# Altium schematic sheet Tiresias_audio_codec.SchDoc: Audio Codec
size 393 x 281 mm; Author: João Victor Colombari Carlet; CompanyName: GMETA; DrawnBy: João Victor Colombari Carlet; Organization: R&D GMETA; Address1: EESC - USP; Address2: 400, Trabalhador São-Carlense Av.; Address3: 13566-590, São Carlos; Address4: São Paulo, Brazil; Revision: 0; SheetNumber: 3; SheetTotal: 5; Address_Website: http://www.sel.eesc.usp.br/jcarmo/metamaterials/
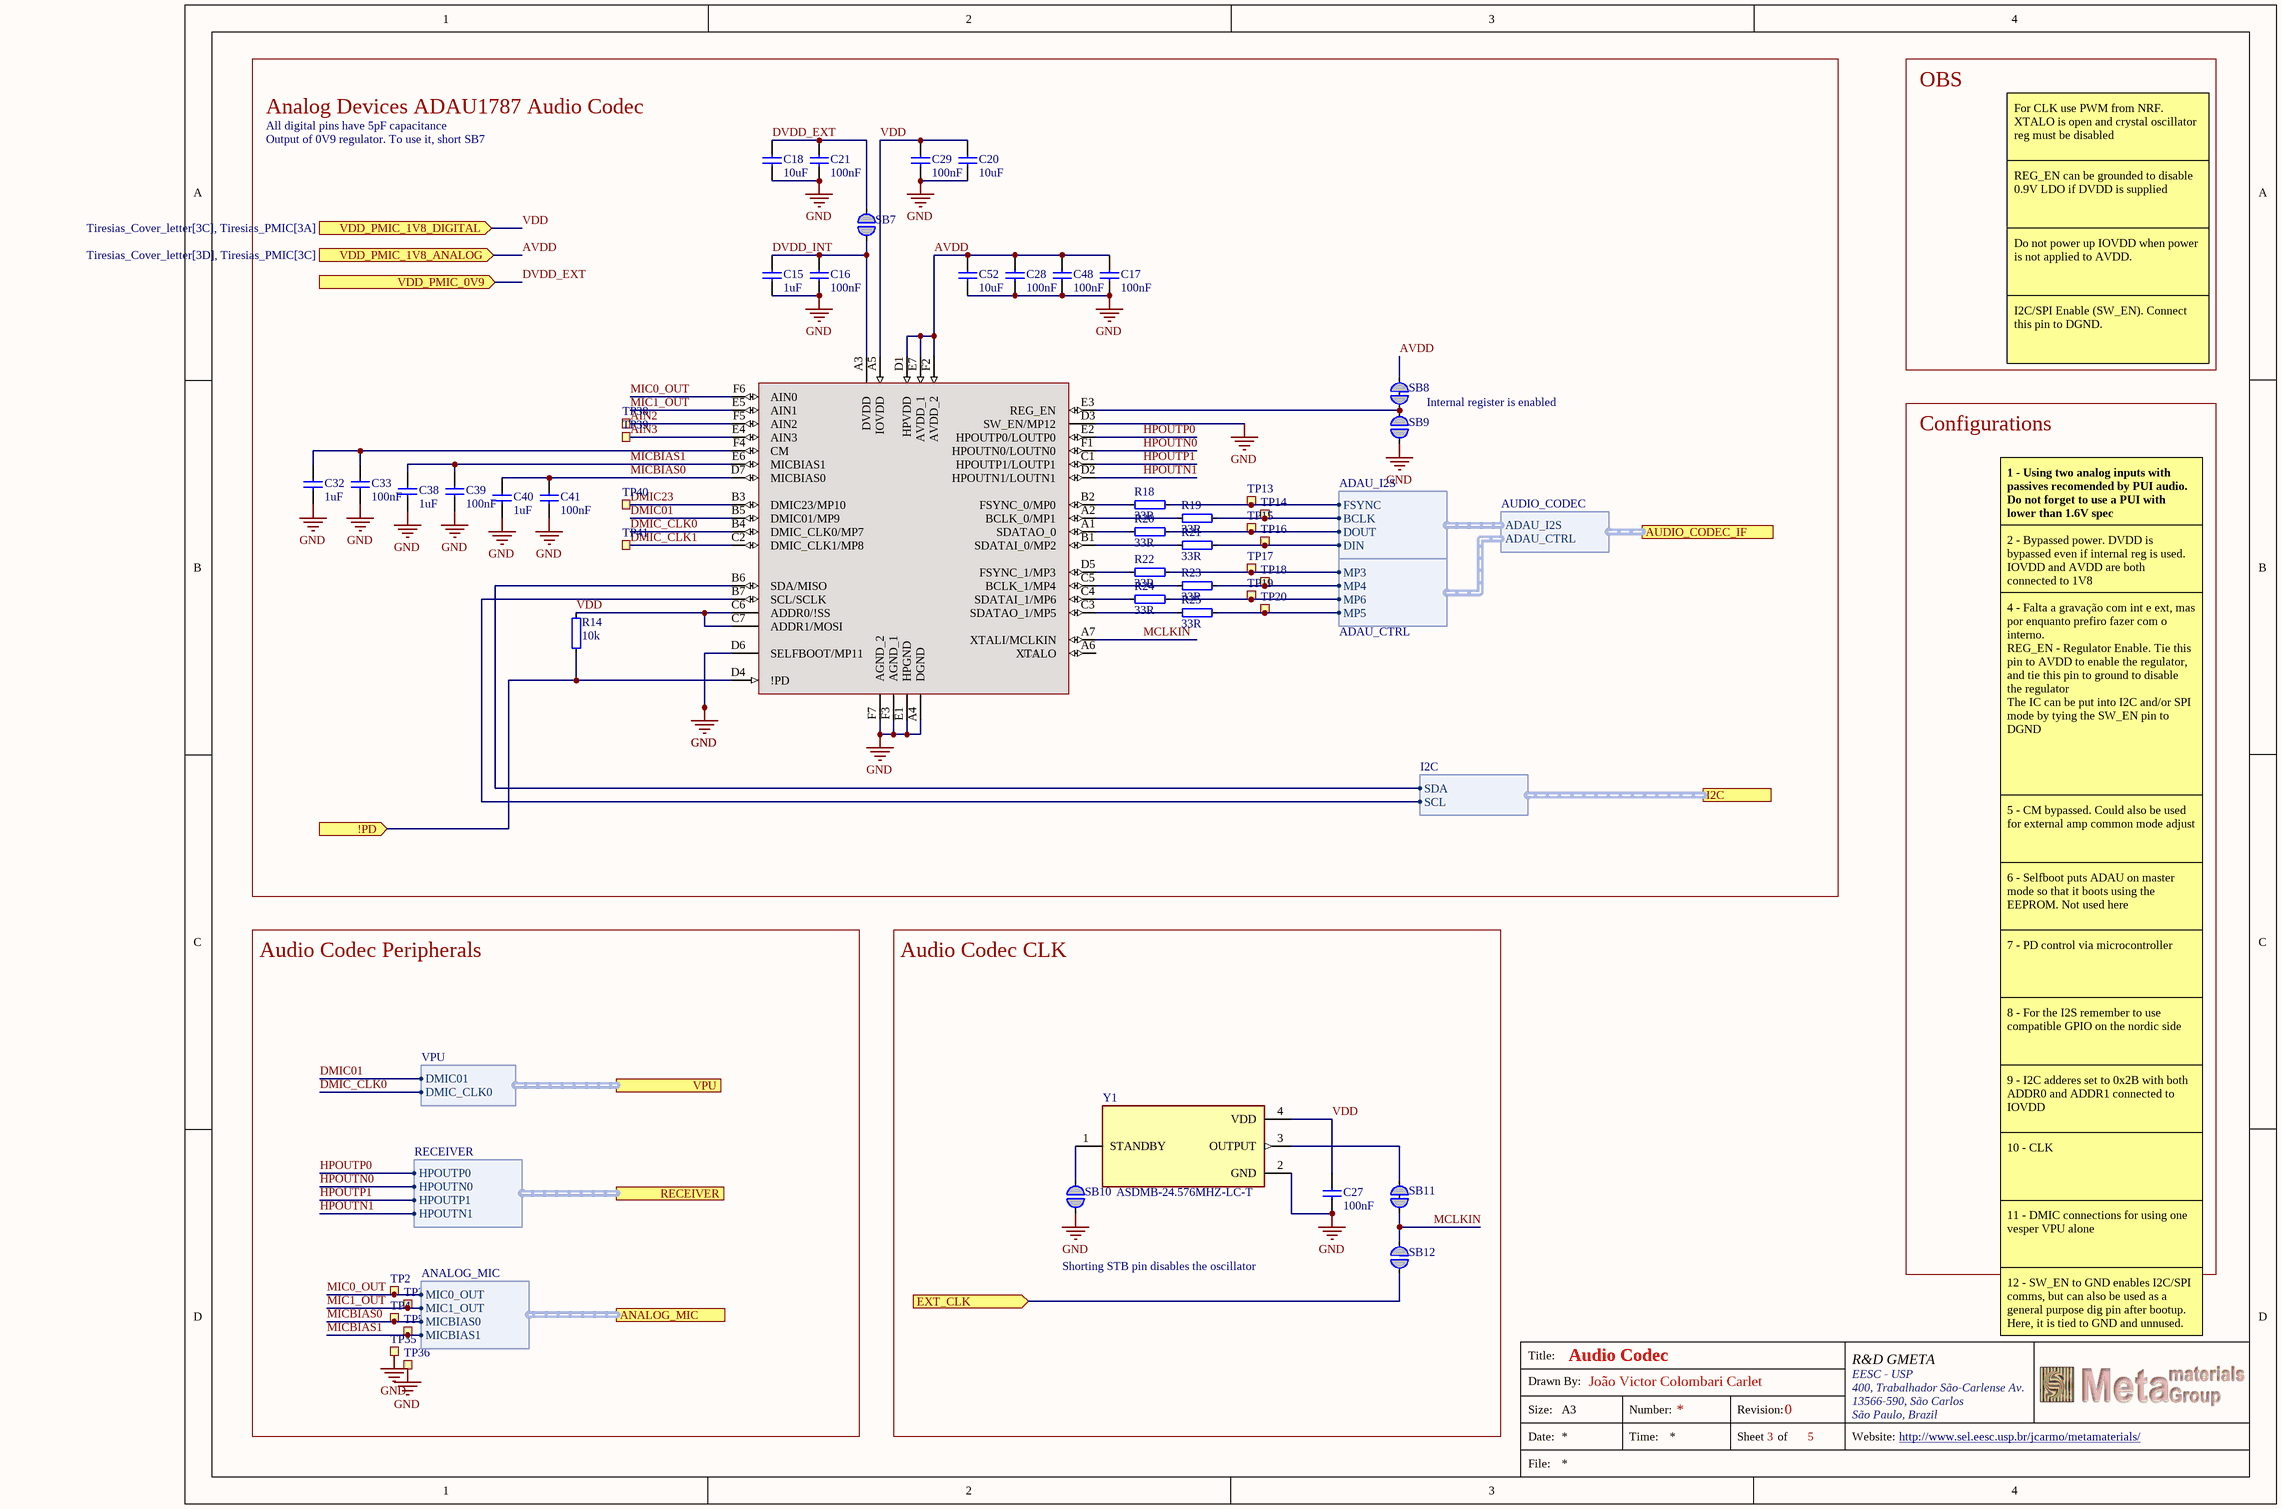
[diagram p0: Tiresias_audio_codec.SchDoc]

## Parts
C15  1uF  [CAPC1005X04L]
C16  100nF  [CAPC0603X03L_C]
C17  100nF  [CAPC0603X03L_C]
C18  10uF  [CAPC1005X04L]
C20  10uF  [CAPC1005X04L]
C21  100nF  [CAPC0603X03L_C]
C27  100nF  [CAPC0603X03L_C]
C28  100nF  [CAPC0603X03L_C]
C29  100nF  [CAPC0603X03L_C]
C32  1uF  [CAPC1005X04L]
C33  100nF  [CAPC0603X03L_C]
C38  1uF  [CAPC1005X04L]
C39  100nF  [CAPC0603X03L_C]
C40  1uF  [CAPC1005X04L]
C41  100nF  [CAPC0603X03L_C]
C48  100nF  [CAPC0603X03L_C]
C52  10uF  [CAPC1005X04L]
IC1  General Purpose Audio Codec 4ADC / 2DAC Ch 42-Pin WLCSP T/R   Source:  Datasheet  [BGA42C35P7X6_270X232X53]  (value not drawn)
R14  10k  [RESC0603X03L_C]
R18  33R  [RESC0603X03L_C]
R19  33R  [RESC0603X03L_C]
R20  33R  [RESC0603X03L_C]
R21  33R  [RESC0603X03L_C]
R22  33R  [RESC0603X03L_C]
R23  33R  [RESC0603X03L_C]
R24  33R  [RESC0603X03L_C]
R25  33R  [RESC0603X03L_C]
SB7  Solderbridge  [Solderbridge]  (value not drawn)  (no BOM)
SB8  Solderbridge  [Solderbridge_Shorted]  (value not drawn)  (net tie, no BOM)
SB9  Solderbridge  [Solderbridge]  (value not drawn)  (no BOM)
SB10  Solderbridge  [Solderbridge]  (value not drawn)  (no BOM)
SB11  Solderbridge  [Solderbridge_Shorted]  (value not drawn)  (net tie, no BOM)
SB12  Solderbridge  [Solderbridge]  (value not drawn)  (no BOM)
TP2  Ø1.0mm,SMD  [TP_SMD_D1.0mm]  (value not drawn)  (no BOM)
TP3  Ø1.0mm,SMD  [TP_SMD_D1.0mm]  (value not drawn)  (no BOM)
TP4  Ø1.0mm,SMD  [TP_SMD_D1.0mm]  (value not drawn)  (no BOM)
TP5  Ø1.0mm,SMD  [TP_SMD_D1.0mm]  (value not drawn)  (no BOM)
TP13  Ø1.0mm,SMD  [TP_SMD_D1.0mm]  (value not drawn)  (no BOM)
TP14  Ø1.0mm,SMD  [TP_SMD_D1.0mm]  (value not drawn)  (no BOM)
TP15  Ø1.0mm,SMD  [TP_SMD_D1.0mm]  (value not drawn)  (no BOM)
TP16  Ø1.0mm,SMD  [TP_SMD_D1.0mm]  (value not drawn)  (no BOM)
TP17  Ø1.0mm,SMD  [TP_SMD_D1.0mm]  (value not drawn)  (no BOM)
TP18  Ø1.0mm,SMD  [TP_SMD_D1.0mm]  (value not drawn)  (no BOM)
TP19  Ø1.0mm,SMD  [TP_SMD_D1.0mm]  (value not drawn)  (no BOM)
TP20  Ø1.0mm,SMD  [TP_SMD_D1.0mm]  (value not drawn)  (no BOM)
TP35  Ø1.0mm,SMD  [TP_SMD_D1.0mm]  (value not drawn)  (no BOM)
TP36  Ø1.0mm,SMD  [TP_SMD_D1.0mm]  (value not drawn)  (no BOM)
TP38  Ø1.0mm,SMD  [TP_SMD_D1.0mm]  (value not drawn)  (no BOM)
TP39  Ø1.0mm,SMD  [TP_SMD_D1.0mm]  (value not drawn)  (no BOM)
TP40  Ø1.0mm,SMD  [TP_SMD_D1.0mm]  (value not drawn)  (no BOM)
TP41  Ø1.0mm,SMD  [TP_SMD_D1.0mm]  (value not drawn)  (no BOM)
Y1  ASDMB-24.576MHZ-LC-T  [XTAL_ASDMB-24.576MHZ-LC-T]

## Blocks framed on the sheet
Analog Devices ADAU1787 Audio Codec: C15-C18 C20 C21 C28 C29 C32 C33 C38-C41 C48 C52 IC1 R14 R18-R25 SB7-SB9 TP13-TP20 TP38-TP41
Audio Codec Peripherals: TP2-TP5 TP35 TP36
Audio Codec CLK: C27 SB10-SB12 Y1

## Ports
!PD (in, see Tiresias_Cover_letter[3D], Tiresias_MCU[4C]), ANALOG_MIC (harness ANALOG_MIC, see Tiresias_Cover_letter[3C], Tiresias_misc[2C]), AUDIO_CODEC_IF (harness AUDIO_CODEC, see Tiresias_Cover_letter[3D], Tiresias_MCU[4D]), EXT_CLK (in, see Tiresias_Cover_letter[3D], Tiresias_MCU[4C]), I2C (harness I2C, see Tiresias_Cover_letter[3C], Tiresias_MCU[4C], Tiresias_misc[2C]), RECEIVER (harness RECEIVER, see Tiresias_Cover_letter[3C], Tiresias_misc[4B]), VDD_PMIC_0V9 (in, see Tiresias_Cover_letter[3C], Tiresias_PMIC[3C]), VDD_PMIC_1V8_ANALOG (in, see Tiresias_Cover_letter[3D], Tiresias_PMIC[3C]), VDD_PMIC_1V8_DIGITAL (in, see Tiresias_Cover_letter[3C], Tiresias_PMIC[3A]), VPU (harness VPU, see Tiresias_Cover_letter[3D], Tiresias_misc[4A])

## Harnesses
ANALOG_MIC: MIC0_OUT, MIC1_OUT, MICBIAS0, MICBIAS1
I2C: SDA, SCL
VPU: DMIC01, DMIC_CLK0
RECEIVER: HPOUTP0, HPOUTN0, HPOUTP1, HPOUTN1
ADAU_I2S: FSYNC, BCLK, DOUT, DIN
ADAU_CTRL: MP3, MP4, MP6, MP5
AUDIO_CODEC: ADAU_I2S, ADAU_CTRL

## Nets
GND: C15.1 C16.2 C17.2 C18.1 C20.1 C21.2 C27.2 C28.2 C29.2 C32.1 C33.2 C38.1 C39.2 C40.1 C41.2 C48.2 C52.1 IC1.A4(DGND) IC1.D3(SW_EN/MP12) IC1.D6(SELFBOOT/MP11) IC1.E1(HPGND) IC1.F3(AGND_1) IC1.F7(AGND_2) SB9.2 SB10.2 TP35.1 TP36.1 Y1.2(GND)
!PD: IC1.D4(!PD) R14.1 ; port !PD
AIN2: IC1.F5(AIN2) TP38.1
AIN3: IC1.E4(AIN3) TP39.1
AVDD: C17.1 C28.1 C48.1 C52.2 IC1.D1(HPVDD) IC1.E7(AVDD_1) IC1.F2(AVDD_2) SB8.1 ; port VDD_PMIC_1V8_ANALOG
DMIC01: IC1.B5(DMIC01/MP9) ; port VPU.DMIC01
DMIC23: IC1.B3(DMIC23/MP10) TP40.1
DMIC_CLK0: IC1.B4(DMIC_CLK0/MP7) ; port VPU.DMIC_CLK0
DMIC_CLK1: IC1.C2(DMIC_CLK1/MP8) TP41.1
DVDD_EXT: C18.2 C21.1 SB7.1 ; port VDD_PMIC_0V9
DVDD_INT: C15.2 C16.1 IC1.A3(DVDD) SB7.2
EXT_CLK: SB12.2 ; port EXT_CLK
HPOUTN0: IC1.F1(HPOUTN0/LOUTN0) ; port RECEIVER.HPOUTN0
HPOUTN1: IC1.D2(HPOUTN1/LOUTN1) ; port RECEIVER.HPOUTN1
HPOUTP0: IC1.E2(HPOUTP0/LOUTP0) ; port RECEIVER.HPOUTP0
HPOUTP1: IC1.C1(HPOUTP1/LOUTP1) ; port RECEIVER.HPOUTP1
MCLKIN: IC1.A7(XTALI/MCLKIN) SB11.2 SB12.1
MIC0_OUT: IC1.F6(AIN0) TP2.1 ; port ANALOG_MIC.MIC0_OUT
MIC1_OUT: IC1.E5(AIN1) TP3.1 ; port ANALOG_MIC.MIC1_OUT
MICBIAS0: C40.2 C41.1 IC1.D7(MICBIAS0) TP4.1 ; port ANALOG_MIC.MICBIAS0
MICBIAS1: C38.2 C39.1 IC1.E6(MICBIAS1) TP5.1 ; port ANALOG_MIC.MICBIAS1
VDD: C20.2 C27.1 C29.1 IC1.A5(IOVDD) IC1.C6(ADDR0/!SS) IC1.C7(ADDR1/MOSI) R14.2 Y1.4(VDD) ; port VDD_PMIC_1V8_DIGITAL
NetC32_2: C32.2 C33.1 IC1.F4(CM)
NetIC1_A1: IC1.A1(SDATAO_0) R20.1
NetIC1_A2: IC1.A2(BCLK_0/MP1) R19.1
NetIC1_B1: IC1.B1(SDATAI_0/MP2) R21.1
NetIC1_B2: IC1.B2(FSYNC_0/MP0) R18.1
NetIC1_B6: IC1.B6(SDA/MISO) ; port I2C.SDA
NetIC1_B7: IC1.B7(SCL/SCLK) ; port I2C.SCL
NetIC1_C3: IC1.C3(SDATAO_1/MP5) R25.1
NetIC1_C4: IC1.C4(SDATAI_1/MP6) R24.1
NetIC1_C5: IC1.C5(BCLK_1/MP4) R23.1
NetIC1_D5: IC1.D5(FSYNC_1/MP3) R22.1
NetIC1_E3: IC1.E3(REG_EN) SB8.2 SB9.1
NetR18_2: R18.2 TP13.1 ; harness ADAU_I2S.FSYNC
NetR19_2: R19.2 TP14.1 ; harness ADAU_I2S.BCLK
NetR20_2: R20.2 TP15.1 ; harness ADAU_I2S.DOUT
NetR21_2: R21.2 TP16.1 ; harness ADAU_I2S.DIN
NetR22_2: R22.2 TP17.1 ; harness ADAU_CTRL.MP3
NetR23_2: R23.2 TP18.1 ; harness ADAU_CTRL.MP4
NetR24_2: R24.2 TP19.1 ; harness ADAU_CTRL.MP6
NetR25_2: R25.2 TP20.1 ; harness ADAU_CTRL.MP5
NetSB10_1: SB10.1 Y1.1(STANDBY)
NetSB11_1: SB11.1 Y1.3(OUTPUT)

Not connected (* = marked no-connect by the designer): IC1 A6(XTALO)

## Notes on the sheet
- OBS
- Output of 0V9 regulator. To use it, short SB7
- All digital pins have 5pF capacitance
- For CLK use PWM from NRF. XTALO is open and crystal oscillator reg must be disabled
- REG_EN can be grounded to disable 0.9V LDO if DVDD is supplied
- Do not power up IOVDD when power is not applied to AVDD.
- I2C/SPI Enable (SW_EN). Connect this pin to DGND.
- Internal register is enabled
- Configurations
- 1 - Using two analog inputs with passives recomended by PUI audio. Do not forget to use a PUI with lower than 1.6V spec
- 2 - Bypassed power. DVDD is bypassed even if internal reg is used. IOVDD and AVDD are both connected to 1V8
- 4 - Falta a gravação com int e ext, mas por enquanto prefiro fazer com o interno.
  REG_EN - Regulator Enable. Tie this pin to AVDD to enable the regulator, and tie this pin to ground to disable the regulator
  The IC can be put into I2C and/or SPI mode by tying the SW_EN pin to DGND
- 5 - CM bypassed. Could also be used for external amp common mode adjust
- 6 - Selfboot puts ADAU on master mode so that it boots using the EEPROM. Not used here
- 7 - PD control via microcontroller
- 8 - For the I2S remember to use compatible GPIO on the nordic side
- 9 - I2C adderes set to 0x2B with both ADDR0 and ADDR1 connected to IOVDD
- 11 - DMIC connections for using one vesper VPU alone
- 10 - CLK
- Shorting STB pin disables the oscillator
- 12 - SW_EN to GND enables I2C/SPI comms, but can also be used as a general purpose dig pin after bootup. Here, it is tied to GND and unnused.
- Title:
- Drawn By:
- Size:
- Date:
- File:
- A3
- Number:
- Time:
- Revision:
- Sheet
- of
- Website:

## Library data of the parts
C15 C32 C38 C40 = CAP_0402_1uF: Capacitor, X5R, ±5%; Part Number: C0402-1µ0; Class: SMT; Manufacturer: *; Manufacturer Part Number: *; LatestRevisionDate: 2024/02/20; Value: 1uF; Package: 0402; Pin Count: 2
C16 C17 C21 C27-C29 C33 C39 C41 C48 = CAP_0201_100nF: Capacitor, NP0, ±2%; Part Number: C0201-100n; Class: SMT; Manufacturer: *; Manufacturer Part Number: *; LatestRevisionDate: 2024/02/20; Value: 100nF; Package: 0201; Pin Count: 2; JLCpcb link: *; Mouser link: *; DigiKey link: *
C18 C20 C52 = CAP_0402_10uF: Capacitor, X5R, ±5%; Part Number: C0402-1µ0; Class: SMT; Manufacturer: *; Manufacturer Part Number: *; LatestRevisionDate: 2024/02/20; Value: 10uF; Package: 0402; Pin Count: 2
IC1 = ADAU1787BCBZRL: Manufacturer_Name: Analog Devices; GateName_1: G$1; SymbolName_1: ADAU1787BCBZRL; LibraryName: ADAU1787BCBZRL; DeviceSetName: ADAU1787BCBZRL; Package: BGA42C35P7X6_270X232X53; Mouser_Part_Number: 584-ADAU1787BCBZRL; Mouser_Price-Stock: https://www.mouser.co.uk/ProductDetail/Analog-Devices/ADAU1787BCBZRL?qs=Zz7%252BYVVL6bEB%252B919c1w04A%3D%3D; Manufacturer_Part_Number: ADAU1787BCBZRL; Height: 0.53mm
R14 = RES_0201_10K: Resistor, ±1%, 0.05W; Part Number: R0201-100k; Manufacturer: N.A.; Class: SMT; Latest Revision Date: 2024-04-23; ComponentLink1URL: N.A.; ComponentLink1Description: Datasheet; ComponentLink2URL: N.A.; ComponentLink2Description: Supplier link; Value: 10k; Package: 0201; Pin Count: 2; JLCpcb link: Chip Res 1%; Mouser link: N.A.; DigiKey link: 00000001419; Author: rsk
R18-R25 = RES_0201_33R: Resistor, ±1%, 0.05W; Part Number: R0201-220; Manufacturer: N.A.; Part number IPS: 00000000863; Pad Count: 2; Note: Chip Res 1%; Footprint Doc: 0201; Value: 33R; Component Class: Resistors; Author: rsk; PartId: 100100032; Manufacturer Part Number: N.A.; ComponentLink1URL: N.A.; ComponentLink1Description: Datasheet; ComponentLink2URL: N.A.; ComponentLink2Description: Supplier link; HelpURL: N.A.; LatestRevisionDate: 2014-11-13; Published: 2014-11-13; Supplier 1: N.A.; Supplier Part Number 1: N.A.; Supplier 2: N.A.; Supplier Part Number 2: N.A.; Artikkelnr Noca: N.A.; Part number Norautron: N.A.
SB7 SB9 SB10 SB12 = Solderbridge: Manufacturer: N.A.; Pad Count: 2; Part Number: Solderbridge; Manufacturer Part Number: N.A.; ComponentLink1URL: N.A.; ComponentLink1Description: Datasheet; ComponentLink2URL: N.A.; ComponentLink2Description: Supplier link; HelpURL: N.A.; Footprint Doc: Solderbridge; LatestRevisionDate: 2009-12-14; Published: 2009-12-14; Value: Solderbridge; Note: N.A.; Supplier 1: N.A.; Supplier Part Number 1: N.A.; Supplier 2: N.A.; Supplier Part Number 2: N.A.; Artikkelnr Noca: N.A.; Part number IPS: N.A.; Component Class: Connectors; PartId: 100500458; Author: rsk; Part number Norautron: N.A.
SB8 SB11 = Solderbridge Shorted: Shorted Solderbridge; Manufacturer: N.A.; Pad Count: 2; Part Number: Solderbridge Shorted; Manufacturer Part Number: N.A.; ComponentLink1URL: N.A.; ComponentLink1Description: Datasheet; ComponentLink2URL: N.A.; ComponentLink2Description: Supplier link; HelpURL: N.A.; Footprint Doc: Solderbridge_Shorted; LatestRevisionDate: 2012-08-07; Published: 2012-08-07; Value: Solderbridge; Note: N.A.; Supplier 1: N.A.; Supplier Part Number 1: N.A.; Supplier 2: N.A.; Supplier Part Number 2: N.A.; Artikkelnr Noca: N.A.; Part number IPS: N.A.; Component Class: Connectors; PartId: 100500459; Author: rsk; Part number Norautron: N.A.
TP2-TP5 TP13-TP20 TP35 TP36 TP38-TP41 = TP_SMD_Ø1.0MM: 1.0mm circular SMD testpad; Manufacturer: Nordic Semiconductor; Manufacturer Part Number: N.A.; Pad Count: 1; Part Number: TP_SMD_Ø1.0MM; ComponentLink1URL: N.A.; ComponentLink1Description: Datasheet; ComponentLink2URL: N.A.; ComponentLink2Description: Supplier link; HelpURL: N.A.; Footprint Doc: TP_SMD_Ø1.0mm; LatestRevisionDate: 2021-03-05; Published: 2013-06-11; Value: Ø1.0mm,SMD; Note: N.A.; Supplier 1: N.A.; Supplier Part Number 1: N.A.; Supplier 2: N.A.; Supplier Part Number 2: N.A.; Artikkelnr Noca: N.A.; Part number IPS: N.A.; Component Class: Connectors; PartId: 100500475; Author: rsk; Part number Norautron: N.A.
Y1 = ASDMB-24.576MHZ-LC-T: Package: None; Price: None; Availability: Unavailable; MP: ASDMB-24.576MHZ-LC-T; Value: *